# Altium project week 4 lab.PrjPcb
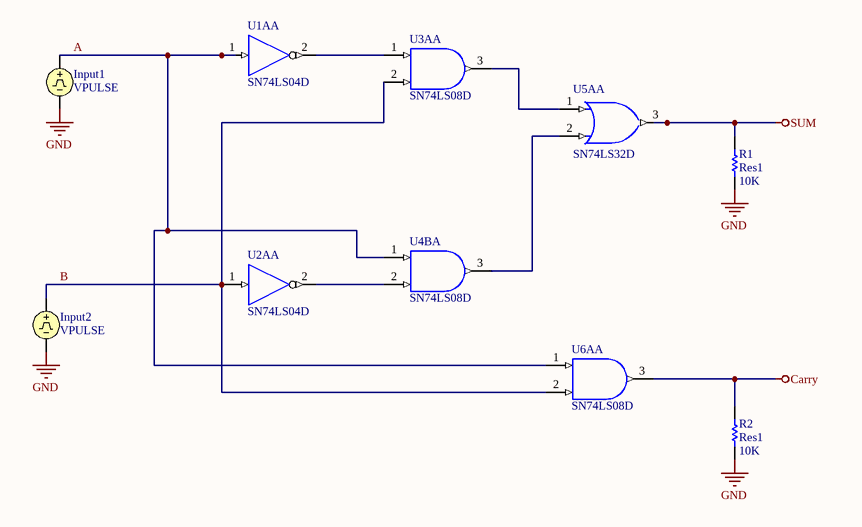
[diagram p0: Sheet1.SchDoc]
1 sheet, 10 parts. Net scope: global (net labels, ports and power ports of the same name join across sheets).

## Sheet Sheet1.SchDoc
size A4

### Parts
Input1  VPULSE
Input2  VPULSE
R1  Res1  value 10K  [AXIAL-0.3]
R2  Res1  value 10K  [AXIAL-0.3]
U1A  SN74LS04D  [D014_N]  (part A of 6)
U2A  SN74LS04D  [D014_N]  (part A of 6)
U3A  SN74LS08D  [D014_N]  (part A of 4)
U4B  SN74LS08D  [D014_N]  (part A of 4)
U5A  SN74LS32D  [D014_N]  (part A of 4)
U6A  SN74LS08D  [D014_N]  (part A of 4)

### Nets
Carry: R2.2 U6A.3(Y)
GND: Input1.2 Input2.2 R1.1 R2.1 U1A.7(GND) U2A.7(GND) U3A.7(GND) U4B.7(GND) U5A.7(GND) U6A.7(GND)
SUM: R1.2 U5A.3(Y)
VCC: U1A.14(VCC) U2A.14(VCC) U3A.14(VCC) U4B.14(VCC) U5A.14(VCC) U6A.14(VCC)
A: Input1.1 U1A.1(A) U4B.1(A) U6A.1(A)
B: Input2.1 U2A.1(A) U3A.2(B) U6A.2(B)
NetU1A_2: U1A.2(Y) U3A.1(A)
NetU2A_2: U2A.2(Y) U4B.2(B)
NetU3A_3: U3A.3(Y) U5A.1(A)
NetU4B_3: U4B.3(Y) U5A.2(B)

### Library data of the parts
Input1 Input2 = VPULSE: Pulse Voltage Source; Note: PCB Footprint - Not required; Published: 8-Jun-2000; LatestRevisionDate: 15-Nov-2004; LatestRevisionNote: Corrected Netlist.; PackageReference: Not Applicable; Publisher: Altium Limited
R1 R2 = Res1: Resistor; Published: 8-Jun-2000; LatestRevisionDate: 17-Jul-2002; LatestRevisionNote: Re-released for DXP Platform.; PackageReference: AXIAL-0.3; Publisher: Altium Limited; PackageDescription: Axial Device, Thru-Hole; 2 Leads; 0.3 in Pin Spacing
U1A U2A = SN74LS04D: Hex Inverter; Published: 8-Jun-2000; LatestRevisionDate: 13-Apr-2006; LatestRevisionNote: IPC-7351 Footprint Added.; DatasheetVersion: Mar-1988; PackageVersion: Jan-1998; PackageReference: D014; Publisher: Altium Limited; PackageDescription: 14-Pin Small Outline Integrated Circuit 1.27 mm Pitch; Code_IPC: SOIC127P600-14; ComponentLink1Description: Manufacturer Link; ComponentLink1URL: http://www.ti.com/; ComponentLink2Description: Datasheet; ComponentLink2URL: http://www-s.ti.com/sc/ds/sn74ls04.pdf
U3A U4B U6A = SN74LS08D: Quadruple 2-Input Positive-AND Gate; Published: 8-Jun-2000; LatestRevisionDate: 13-Apr-2006; LatestRevisionNote: IPC-7351 Footprint Added.; DatasheetVersion: Mar-1988; PackageVersion: Jan-1998; PackageReference: D014; Publisher: Altium Limited; PackageDescription: 14-Pin Small Outline Integrated Circuit 1.27 mm Pitch; Code_IPC: SOIC127P600-14; ComponentLink1Description: Manufacturer Link; ComponentLink1URL: http://www.ti.com/; ComponentLink2Description: Datasheet; ComponentLink2URL: http://www-s.ti.com/sc/ds/SN74LS08.pdf
U5A = SN74LS32D: Quadruple 2-Input Positive-OR Gate; Published: 8-Jun-2000; LatestRevisionDate: 13-Apr-2006; LatestRevisionNote: IPC-7351 Footprint Added.; DatasheetVersion: Mar-1988; PackageVersion: Jan-1998; PackageReference: D014; Publisher: Altium Limited; PackageDescription: 14-Pin Small Outline Integrated Circuit 1.27 mm Pitch; Code_IPC: SOIC127P600-14; ComponentLink1Description: Manufacturer Link; ComponentLink1URL: http://www.ti.com/; ComponentLink2Description: Datasheet; ComponentLink2URL: http://www-s.ti.com/sc/ds/sn74ls32.pdf